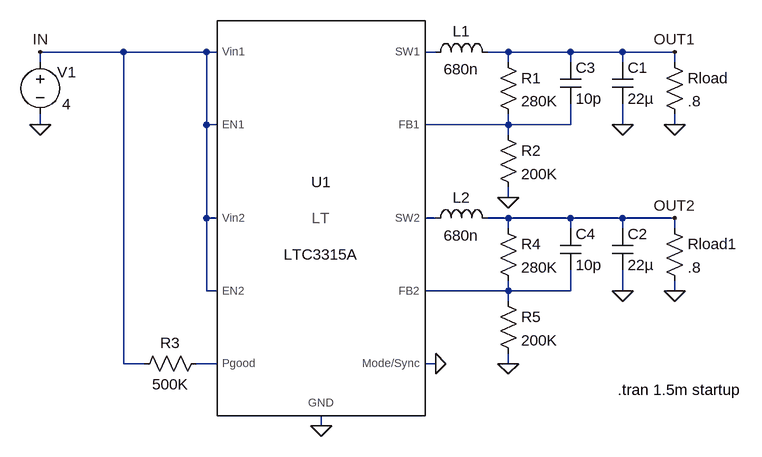
[diagram p0: schematic 3315A.asc]
3315A.asc, the LTspice schematic file:
Version 4
SHEET 1 2652 2184
WIRE 1408 1472 1280 1472
WIRE 1536 1472 1408 1472
WIRE 1552 1472 1536 1472
WIRE 1888 1472 1872 1472
WIRE 2000 1472 1968 1472
WIRE 2096 1472 2000 1472
WIRE 2176 1472 2096 1472
WIRE 2256 1472 2176 1472
WIRE 1280 1488 1280 1472
WIRE 2000 1488 2000 1472
WIRE 2096 1488 2096 1472
WIRE 2176 1488 2176 1472
WIRE 2256 1488 2256 1472
WIRE 1280 1584 1280 1568
WIRE 1536 1584 1536 1472
WIRE 1552 1584 1536 1584
WIRE 2000 1584 2000 1568
WIRE 2000 1584 1872 1584
WIRE 2096 1584 2096 1552
WIRE 2096 1584 2000 1584
WIRE 2176 1584 2176 1552
WIRE 2256 1584 2256 1568
WIRE 2000 1600 2000 1584
WIRE 2000 1696 2000 1680
WIRE 1536 1728 1536 1584
WIRE 1552 1728 1536 1728
WIRE 1888 1728 1872 1728
WIRE 2000 1728 1968 1728
WIRE 2096 1728 2000 1728
WIRE 2176 1728 2096 1728
WIRE 2256 1728 2176 1728
WIRE 2000 1744 2000 1728
WIRE 2096 1744 2096 1728
WIRE 2176 1744 2176 1728
WIRE 2256 1744 2256 1728
WIRE 1536 1840 1536 1728
WIRE 1552 1840 1536 1840
WIRE 2000 1840 2000 1824
WIRE 2000 1840 1872 1840
WIRE 2096 1840 2096 1808
WIRE 2096 1840 2000 1840
WIRE 2176 1840 2176 1808
WIRE 2256 1840 2256 1824
WIRE 2000 1856 2000 1840
WIRE 1408 1952 1408 1472
WIRE 1440 1952 1408 1952
WIRE 1552 1952 1520 1952
WIRE 1888 1952 1872 1952
WIRE 2000 1952 2000 1936
WIRE 1712 2048 1712 2032
FLAG 1712 2048 0
FLAG 1280 1584 0
FLAG 2256 1584 0
FLAG 2000 1696 0
FLAG 2176 1584 0
FLAG 1280 1472 IN
FLAG 2256 1472 OUT1
FLAG 1888 1952 0
FLAG 2256 1840 0
FLAG 2000 1952 0
FLAG 2176 1840 0
FLAG 2256 1728 OUT2
SYMBOL ind 1872 1488 R270
WINDOW 0 32 56 VTop 2
WINDOW 3 5 56 VBottom 2
SYMATTR InstName L1
SYMATTR Value 680n
SYMATTR SpiceLine Rser=2m
SYMBOL RES 1984 1472 R0
SYMATTR InstName R1
SYMATTR Value 280K
SYMBOL VOLTAGE 1280 1472 R0
WINDOW 0 26 31 Left 2
WINDOW 3 34 80 Left 2
SYMATTR InstName V1
SYMATTR Value 4
SYMBOL res 1984 1584 R0
SYMATTR InstName R2
SYMATTR Value 200K
SYMBOL cap 2160 1488 R0
SYMATTR InstName C1
SYMATTR Value 22µ
SYMBOL cap 2080 1488 R0
SYMATTR InstName C3
SYMATTR Value 10p
SYMBOL res 2240 1472 R0
SYMATTR InstName Rload
SYMATTR Value .8
SYMBOL LTC3315A 1712 1664 R0
SYMATTR InstName U1
SYMBOL res 1536 1936 R90
WINDOW 0 0 56 VBottom 2
WINDOW 3 32 56 VTop 2
SYMATTR InstName R3
SYMATTR Value 500K
SYMBOL ind 1872 1744 R270
WINDOW 0 32 56 VTop 2
WINDOW 3 5 56 VBottom 2
SYMATTR InstName L2
SYMATTR Value 680n
SYMATTR SpiceLine Rser=2m
SYMBOL RES 1984 1728 R0
SYMATTR InstName R4
SYMATTR Value 280K
SYMBOL res 1984 1840 R0
SYMATTR InstName R5
SYMATTR Value 200K
SYMBOL cap 2160 1744 R0
SYMATTR InstName C2
SYMATTR Value 22µ
SYMBOL cap 2080 1744 R0
SYMATTR InstName C4
SYMATTR Value 10p
SYMBOL res 2240 1728 R0
SYMATTR InstName Rload1
SYMATTR Value .8
TEXT 2168 1992 Left 2 !.tran 1.5m startup

The netlist it stands for:
* 3315A.asc
L1 N001 OUT1 680n Rser=2m
R1 OUT1 N002 280K
V1 IN 0 4
R2 N002 0 200K
C1 OUT1 0 22µ
C3 OUT1 N002 10p
Rload OUT1 0 .8
XU1 IN IN N001 N002 0 IN IN N005 0 N003 N004 LTC3315A  ; pins Vin1 EN1 SW1 FB1 GND Vin2 EN2 Pgood Mode/Sync SW2 FB2
R3 N005 IN 500K
L2 N003 OUT2 680n Rser=2m
R4 OUT2 N004 280K
R5 N004 0 200K
C2 OUT2 0 22µ
C4 OUT2 N004 10p
Rload1 OUT2 0 .8
.tran 1.5m startup
.lib LTC3315A.sub
.backanno
.end